# EAGLE schematic Juniordesignfilterandenvelopecircuitschematic (EAGLE 9.6.2)
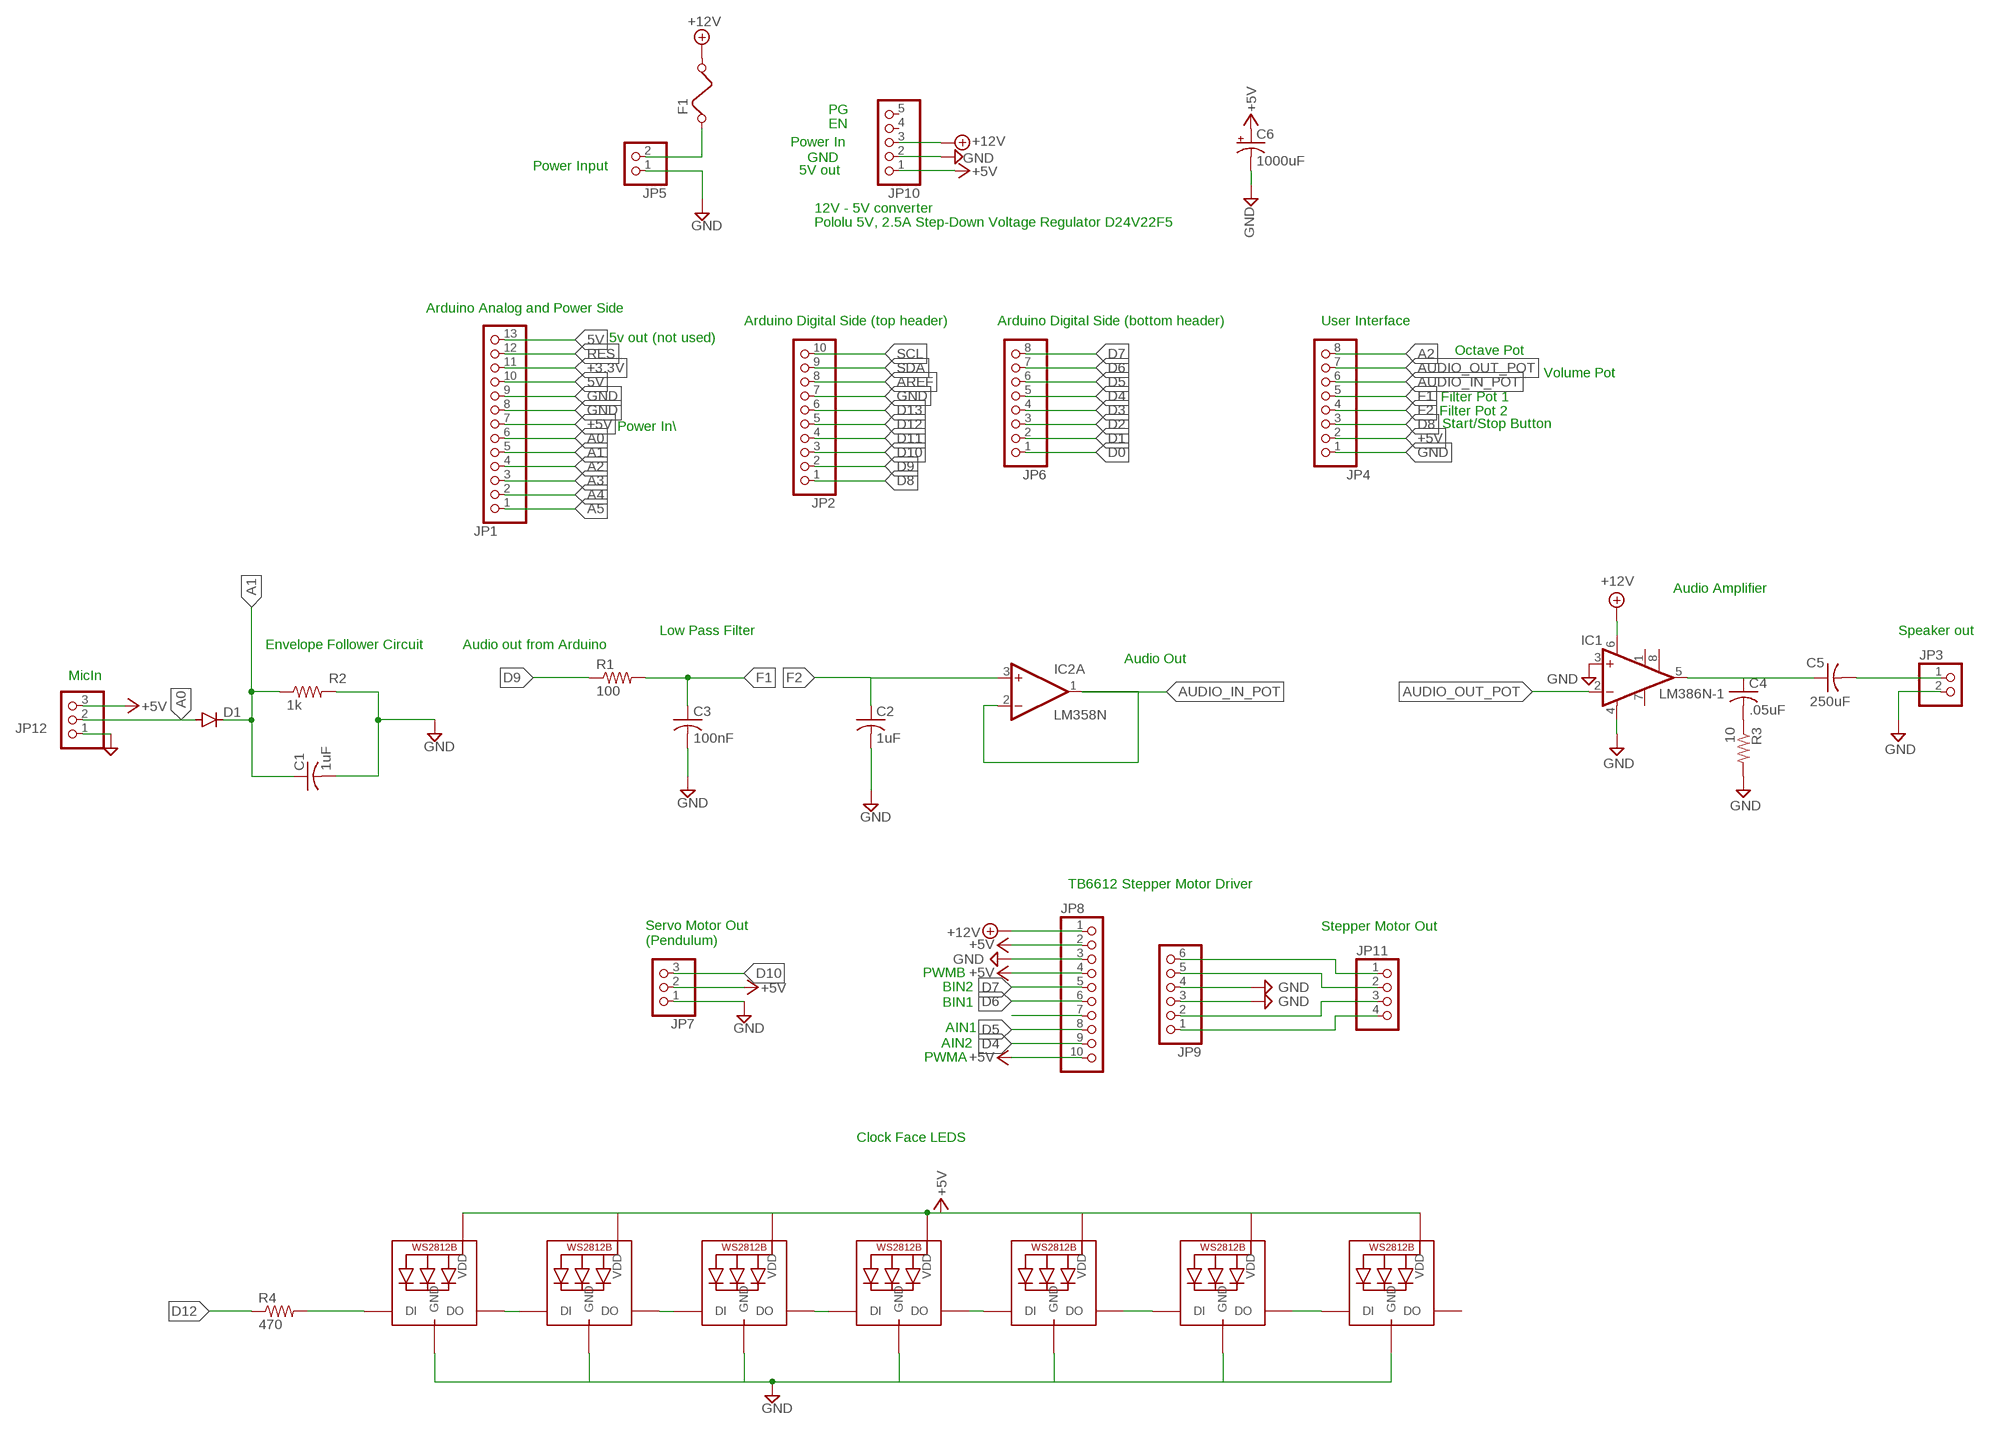
[diagram p0: schematic, sheet 1]

## Parts
C1  1uF  C-US025-050X050  [C025-050X050]
C2  1uF  C-US025-040X050  [C025-040X050]
C3  100nF  C-US025-040X050  [C025-040X050]
C4  .05uF  C-US025-040X050  [C025-040X050]
C5  250uF  C-US025-040X050  [C025-040X050]
C6  1000uF  CPOL-USE5-8.5  [E5-8,5]
D1  1N4148DO35-7  [DO35-7]
F1  FUSE  [FUSE]
IC1  LM386N-1  [DIL08]
IC2  LM358N  [DIL08]
JP1  PINHD-1X13  [1X13]
JP2  PINHD-1X10  [1X10]
JP3  PINHD-1X2  [1X02]
JP4  PINHD-1X8  [1X08]
JP5  PINHD-1X2  [1X02]
JP6  PINHD-1X8  [1X08]
JP7  PINHD-1X3  [1X03]
JP8  PINHD-1X10  [1X10]
JP9  PINHD-1X6  [1X06]
JP10  PINHD-1X5  [1X05]
JP11  PINHD-1X4  [1X04]
JP12  PINHD-1X3  [1X03]
LED2  WS2812B_5050N  [WS2812B-NARROW]
LED3  WS2812B_5050N  [WS2812B-NARROW]
LED4  WS2812B_5050N  [WS2812B-NARROW]
LED5  WS2812B_5050N  [WS2812B-NARROW]
LED6  WS2812B_5050N  [WS2812B-NARROW]
LED7  WS2812B_5050N  [WS2812B-NARROW]
LED8  WS2812B_5050N  [WS2812B-NARROW]
R1  100  R-US_0204/7  [0204/7]
R2  1k  R-US_0204/7  [0204/7]
R3  10  R-US_0204/7  [0204/7]
R4  470  R-US_0204/7  [0204/7]

## Nets
5V: JP1.10 JP1.13
+3.3V: JP1.11
+5V: C6.+ JP1.7 JP4.2 JP7.2 JP8.2 JP8.4 JP8.10 JP10.1 JP12.3 LED2.1-VDD(VDD) LED3.1-VDD(VDD) LED4.1-VDD(VDD) LED5.1-VDD(VDD) LED6.1-VDD(VDD) LED7.1-VDD(VDD) LED8.1-VDD(VDD)
+12V: F1.2 IC1.6(VS) JP8.1 JP10.3
A0: D1.A JP1.6 JP12.2
A1: C1.1 D1.C JP1.5 R2.1
A2: JP1.4 JP4.8
A3: JP1.3
A4: JP1.2
A5: JP1.1
AREF: JP2.8
AUDIO_IN_POT: IC2.1(A:OUT) IC2.2(A:-IN) JP4.6
AUDIO_OUT_POT: IC1.2(-IN) JP4.7
D0: JP6.1
D1: JP6.2
D2: JP6.3
D3: JP6.4
D4: JP6.5 JP8.9
D5: JP6.6 JP8.8
D6: JP6.7 JP8.6
D7: JP6.8 JP8.5
D8: JP2.1 JP4.3
D9: JP2.2 R1.1
D10: JP2.3 JP7.3
D11: JP2.4
D12: JP2.5 R4.1
D13: JP2.6
F1: C3.1 JP4.5 R1.2
F2: C2.1 IC2.3(A:+IN) JP4.4
GND: C1.2 C2.2 C3.2 C6.- IC1.3(+IN) IC1.4(GND) JP1.8 JP1.9 JP2.7 JP3.2 JP4.1 JP5.1 JP7.1 JP8.3 JP9.3 JP9.4 JP10.2 JP12.1 LED2.3-GND(GND) LED3.3-GND(GND) LED4.3-GND(GND) LED5.3-GND(GND) LED6.3-GND(GND) LED7.3-GND(GND) LED8.3-GND(GND) R2.2 R3.2
N$1: C4.2 R3.1
N$2: F1.1 JP5.2
N$3: LED2.4-DIN(DI) R4.2
N$4: C4.1 C5.1 IC1.5(OUT)
N$5: C5.2 JP3.1
N$6: LED2.2-DOUT(DO) LED3.4-DIN(DI)
N$7: LED4.2-DOUT(DO) LED5.4-DIN(DI)
N$8: LED5.2-DOUT(DO) LED6.4-DIN(DI)
N$9: LED6.2-DOUT(DO) LED7.4-DIN(DI)
N$10: LED7.2-DOUT(DO) LED8.4-DIN(DI)
N$11: LED3.2-DOUT(DO) LED4.4-DIN(DI)
N$17: JP8.7
N$21: JP9.6 JP11.1
N$22: JP9.5 JP11.2
N$25: JP9.2 JP11.3
N$26: JP9.1 JP11.4
RES: JP1.12
SCL: JP2.10
SDA: JP2.9
Unconnected: IC1.1(GAIN) IC1.7(BYPASS) IC1.8(GAIN) IC2.5(B:+IN) IC2.6(B:-IN) IC2.7(B:OUT) JP10.4 JP10.5 LED8.2-DOUT(DO)

## Notes on the sheet
- PG
- EN
- Power In
- GND
- Power Input
- 5V out
- 12V - 5V converter
- Pololu 5V, 2.5A Step-Down Voltage Regulator D24V22F5
- Arduino Analog and Power Side
- Arduino Digital Side (top header) | Arduino Digital Side (bottom header) | User Interface
- 5v out (not used)
- Octave Pot
- Volume Pot
- Filter Pot 1
- Filter Pot 2
- Power In\ | Start/Stop Button
- Audio Amplifier
- Low Pass Filter | Speaker out
- Envelope Follower Circuit | Audio out from Arduino
- Audio Out
- MicIn
- TB6612 Stepper Motor Driver
- Stepper Motor Out
- Servo Motor Out
  (Pendulum)
- PWMB
- BIN2
- BIN1
- AIN1
- AIN2
- PWMA
- Clock Face LEDS

## Power pins joined to a net without a drawn wire
V+: IC2.8(P:V+)
V-: IC2.4(P:V-)

## Library data of the parts
C1-C5 = adafruit:C-US: CAPACITOR, American symbol
C6 = adafruit:CPOL-US: POLARIZED CAPACITOR, American symbol
D1 = diode:1N4148: DIODE high speed (Philips)
F1 = special:FUSE: FUSE 5 x 20 mm
IC1 = linear:LM386?-*: Low Voltage Audio Power Amplifier Source: http://cache.national.com/ds/LM/LM386.pdf
IC2 = linear:LM358: OP AMP also LM158; LM258; LM2904 Source: http://cache.national.com/ds/LM/LM158.pdf
JP1 = pinhead:PINHD-1X13: PIN HEADER
JP2 JP8 = pinhead:PINHD-1X10: PIN HEADER
JP3 JP5 = pinhead:PINHD-1X2: PIN HEADER
JP4 JP6 = pinhead:PINHD-1X8: PIN HEADER
JP7 JP12 = pinhead:PINHD-1X3: PIN HEADER
JP9 = pinhead:PINHD-1X6: PIN HEADER
JP10 = pinhead:PINHD-1X5: PIN HEADER
JP11 = pinhead:PINHD-1X4: PIN HEADER
LED2-LED8 = adafruit:WS2812B
R1-R4 = adafruit:R-US_: RESISTOR, American symbol